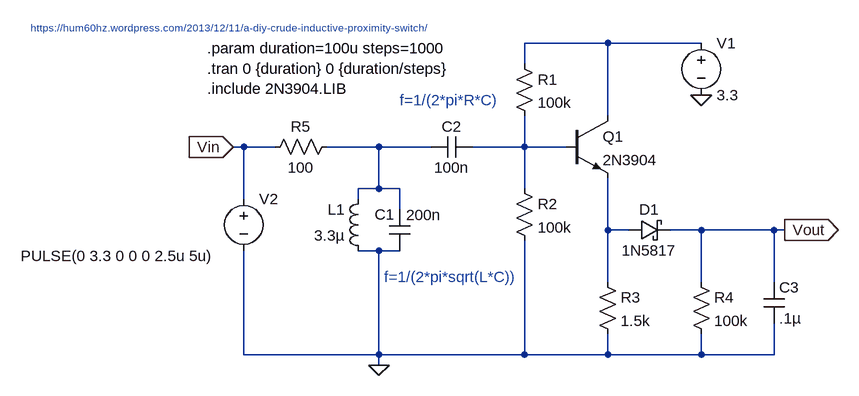
[diagram p0: schematic inductive-sensor2.asc]
inductive-sensor2.asc, the LTspice schematic file:
Version 4
SHEET 1 880 680
WIRE 288 64 160 64
WIRE 432 64 288 64
WIRE 160 96 160 64
WIRE 288 176 288 64
WIRE -272 224 -288 224
WIRE -224 224 -272 224
WIRE -64 224 -144 224
WIRE 16 224 -64 224
WIRE 160 224 160 176
WIRE 160 224 80 224
WIRE 224 224 160 224
WIRE -64 288 -64 224
WIRE -64 288 -96 288
WIRE -32 288 -64 288
WIRE 160 288 160 224
WIRE -272 304 -272 224
WIRE -96 304 -96 288
WIRE -32 320 -32 288
WIRE 288 352 288 272
WIRE 320 352 288 352
WIRE 432 352 384 352
WIRE 544 352 432 352
WIRE 560 352 544 352
WIRE -64 384 -96 384
WIRE -32 384 -64 384
WIRE 288 432 288 352
WIRE 432 432 432 352
WIRE 544 432 544 352
WIRE -272 544 -272 384
WIRE -64 544 -64 384
WIRE -64 544 -272 544
WIRE 160 544 160 368
WIRE 160 544 -64 544
WIRE 288 544 288 512
WIRE 288 544 160 544
WIRE 432 544 432 512
WIRE 432 544 288 544
WIRE 544 544 544 496
WIRE 544 544 432 544
WIRE -64 560 -64 544
FLAG 560 352 Vout
IOPIN 560 352 Out
FLAG -64 560 0
FLAG 432 144 0
FLAG -288 224 Vin
IOPIN -288 224 In
SYMBOL npn 224 176 R0
SYMATTR InstName Q1
SYMATTR Value 2N3904
SYMBOL schottky 320 368 R270
WINDOW 0 32 32 VTop 2
WINDOW 3 0 32 VBottom 2
SYMATTR InstName D1
SYMATTR Value 1N5817
SYMATTR Description Diode
SYMATTR Type diode
SYMBOL Res 144 80 R0
SYMATTR InstName R1
SYMATTR Value 100k
SYMBOL Res 144 272 R0
SYMATTR InstName R2
SYMATTR Value 100k
SYMBOL Res 272 416 R0
SYMATTR InstName R3
SYMATTR Value 1.5k
SYMBOL Res 416 416 R0
SYMATTR InstName R4
SYMATTR Value 100k
SYMBOL Res -128 208 R90
WINDOW 0 0 56 VBottom 2
WINDOW 3 32 56 VTop 2
SYMATTR InstName R5
SYMATTR Value 100
SYMBOL ind -80 400 R180
WINDOW 0 36 80 Left 2
WINDOW 3 36 40 Left 2
SYMATTR InstName L1
SYMATTR Value 3.3µ
SYMATTR SpiceLine Rser=.05
SYMBOL Cap -16 384 R180
WINDOW 0 24 56 Left 2
WINDOW 3 -48 55 Left 2
SYMATTR InstName C1
SYMATTR Value 200n
SYMATTR SpiceLine Rser=.1
SYMBOL Cap 80 208 R90
WINDOW 0 0 32 VBottom 2
WINDOW 3 32 32 VTop 2
SYMATTR InstName C2
SYMATTR Value 100n
SYMBOL Cap 528 432 R0
SYMATTR InstName C3
SYMATTR Value .1µ
SYMBOL Voltage 432 48 R0
SYMATTR InstName V1
SYMATTR Value 3.3
SYMBOL Voltage -272 288 R0
WINDOW 3 -343 104 Left 2
SYMATTR InstName V2
SYMATTR Value PULSE(0 3.3 0 0 0 2.5u 5u)
TEXT -328 72 Left 2 !.param duration=100u steps=1000\n.tran 0 {duration} 0 {duration/steps}\n.include 2N3904.LIB
TEXT -32 152 Left 2 ;f=1/(2*pi*R*C)
TEXT -56 424 Left 2 ;f=1/(2*pi*sqrt(L*C))
TEXT -600 40 Left 1 ;https://hum60hz.wordpress.com/2013/12/11/a-diy-crude-inductive-proximity-switch/

The netlist it stands for:
* inductive-sensor2.asc
Q1 N001 N003 N004 0 2N3904
D1 N004 Vout 1N5817
R1 N001 N003 100k
R2 N003 0 100k
R3 N004 0 1.5k
R4 Vout 0 100k
R5 N002 Vin 100
L1 0 N002 3.3µ Rser=.05
C1 0 N002 200n Rser=.1
C2 N003 N002 100n
C3 Vout 0 .1µ
V1 N001 0 3.3
V2 Vin 0 PULSE(0 3.3 0 0 0 2.5u 5u)
.model D D
.lib standard.dio
.model NPN NPN
.model PNP PNP
.lib standard.bjt
.param duration=100u steps=1000
.tran 0 {duration} 0 {duration/steps}
.include 2N3904.LIB
* f=1/(2*pi*R*C)
* f=1/(2*pi*sqrt(L*C))
* https://hum60hz.wordpress.com/2013/12/11/a-diy-crude-inductive-proximity-switch/
.backanno
.end